# Altium schematic sheet Power.SchDoc: Power
size Letter; DocumentNumber: 4; SheetNumber: 4; SheetTotal: 11
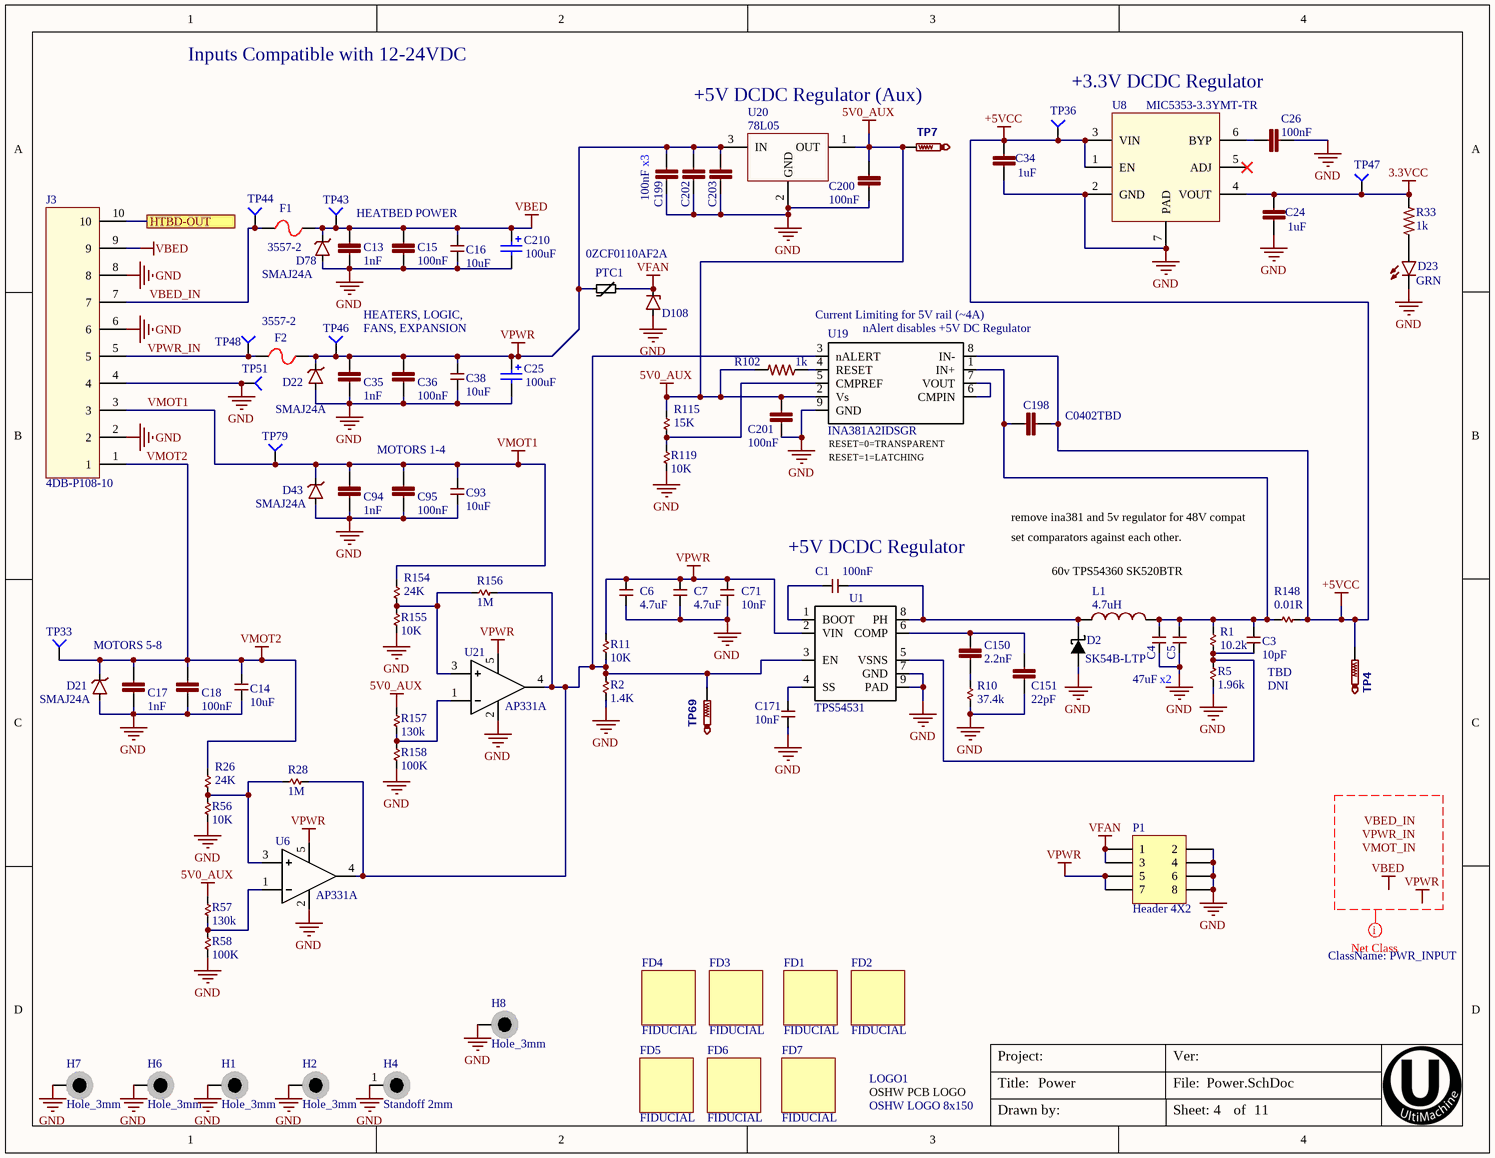
[diagram p0: Power.SchDoc]

## Parts
C1  100nF  [C0603]
C3  10pF  PART DESCRIPTION: TBD  [C0402]
C4  47uF  [C1210]
C5  47uF  [C1210]  (value not drawn)
C6  4.7uF  [C1210]
C7  4.7uF  [C1210]
C13  1nF  [C0402]
C14  10uF  [C1206]
C15  100nF  [C0603]
C16  10uF  [C1206]
C17  1nF  [C0402]
C18  100nF  [C0603]
C24  1uF  [C0402]
C25  value 100uF  [CAP-ELEC-063063077]  (hidden comment: UWT1V101MCL1GS)
C26  100nF  [C0402]
C34  1uF  [C0402]
C35  1nF  [C0402]
C36  100nF  [C0603]
C38  10uF  [C1206]
C71  10nF  [C0402]
C93  10uF  [C1206]
C94  1nF  [C0402]
C95  100nF  [C0603]
C150  2.2nF  [C0402]
C151  22pF  [C0402]
C171  10nF  [C0402]
C198  C0402TBD  [C0402]
C199  100nF  [C0603]
C200  100nF  [C0402]
C201  100nF  [C0402]
C202  100nF  [C0603]  (value not drawn)
C203  100nF  [C0603]  (value not drawn)
C210  value 100uF  [CAP-ELEC-063063077]  (hidden comment: UWT1V101MCL1GS)
D2  SK54B-LTP  [SMB_DO-214AA_LRG]
D21  SMAJ24A  [SMA-SM]
D22  SMAJ24A  [SMA-SM]
D23  GRN  [LED2012120]
D43  SMAJ24A  [SMA-SM]
D78  SMAJ24A  [SMA-SM]
D108  TVS 30V SMF  [SMF]  (value not drawn)
F1  3557-2  [3557]
F2  3557-2  [3557]
FD1  FIDUCIAL  [FIDUCIAL-1X2]
FD2  FIDUCIAL  [FIDUCIAL-1X2]
FD3  FIDUCIAL  [FIDUCIAL-1X2]
FD4  FIDUCIAL  [FIDUCIAL-1X2]
FD5  FIDUCIAL  [FIDUCIAL-1X2]
FD6  FIDUCIAL  [FIDUCIAL-1X2]
FD7  FIDUCIAL  [FIDUCIAL-1X2]
H1  Hole_3mm  [HOLE 3mm]  (no BOM)
H2  Hole_3mm  [HOLE 3mm]  (no BOM)
H4  Standoff 2mm  [Standoff SMT-M2 5mm Tall]
H6  Hole_3mm  [HOLE 3mm]  (no BOM)
H7  Hole_3mm  [HOLE 3mm]  (no BOM)
H8  Hole_3mm  [HOLE 3mm]  (no BOM)
J3  4DB-P108-10  [CON-Barrier-10-8.26mm]
L1  4.7uH  [IND_10X10]
LOGO1  OSHW LOGO 8x150  [OSHW_8X150_NOTEXT]  (no BOM)
P1  Header 4X2  [HDR2X4]
PTC1  0ZCF0110AF2A  [PTC_0ZCF]
R1  10.2k  [R0402]
R2  1.4K  [R0402]
R5  1.96k  [R0402]
R10  37.4k  [R0402]
R11  10K  [R0402]
R26  24K  [R0402]
R28  1M  [R0402]
R33  1k  [R0402]
R56  10K  [R0402]
R57  130k  [R0402]
R58  100K  [R0402]
R102  1k  [R0402]
R115  15K  [R0402]
R119  10K  [R0402]
R148  0.01R  [R0805]
R154  24K  [R0402]
R155  10K  [R0402]
R156  1M  [R0402]
R157  130k  [R0402]
R158  100K  [R0402]
TP4  TestPoint  [TP1-27]  (value not drawn)  (no BOM)
TP7  TestPoint  [TP1-27]  (value not drawn)  (no BOM)
TP33  TP4  [TP-2]  (value not drawn)  (no BOM)
TP36  TP4  [TP-2]  (value not drawn)  (no BOM)
TP43  TP4  [TP-2]  (value not drawn)  (no BOM)
TP44  TP4  [TP-2]  (value not drawn)  (no BOM)
TP46  TP4  [TP-2]  (value not drawn)  (no BOM)
TP47  TP4  [TP-2]  (value not drawn)  (no BOM)
TP48  TP4  [TP-2]  (value not drawn)  (no BOM)
TP51  TP4  [TP-2]  (value not drawn)  (no BOM)
TP69  TestPoint  [TP1-27]  (value not drawn)  (no BOM)
TP79  TP4  [TP-2]  (value not drawn)  (no BOM)
U1  TPS54531  [SOIC127P600X170_HS-9L]
U6  AP331A  [SOT23-5]
U8  MIC5353-3.3YMT-TR  [TDFN1616-6LD-PL-1]
U19  INA381A2IDSGR  [WSON8_2x2mm]
U20  78L05  [SOT-89-3]
U21  AP331A  [SOT23-5]

## Ports
HTBD-OUT

## Nets
3.3VCC: C24.1 R33.2 TP47.1 U8.4(VOUT)
5V0_AUX: C200.2 C201.2 R57.2 R102.2 R115.2 R157.2 TP7.TP U19.2(Vs) U20.1(OUT)
+5VCC: C34.1 C198.1 R148.2 TP4.TP TP36.1 U8.1(EN) U8.3(VIN) U19.8(IN-)
GND: C4.1 C5.1 C6.1 C7.1 C13.2 C14.1 C15.2 C16.1 C17.2 C18.2 C24.2 C25.2 C26.2 C34.2 C35.2 C36.2 C38.1 C71.1 C93.1 C94.2 C95.2 C151.1 C171.1 C199.2 C200.1 C201.1 C202.2 C203.2 C210.2 D2.A(ANODE) D21.A D22.A D23.C D43.A D78.A D108.A H1.?1 H2.?1 H4.1 H6.?1 H7.?1 H8.?1 J3.2 J3.4 J3.6 J3.8 P1.2 P1.4 P1.6 P1.8 R2.1 R5.1 R10.1 R56.1 R58.1 R119.1 R155.1 R158.1 TP51.1 U1.7(GND) U1.9(PAD) U6.2(GND) U8.2(GND) U8.7(PAD) U19.9(GND) U20.2(GND) U21.2(GND)
VBED: C13.1 C15.1 C16.2 C210.1 D78.K F1.2 J3.9 TP43.1
VFAN: D108.K P1.1 P1.3 PTC1.2
VMOT1: C93.2 C94.1 C95.1 D43.K J3.3 R154.1 TP79.1
VMOT2: C14.2 C17.1 C18.1 D21.K J3.1 R26.1 TP33.1
VPWR: C6.2 C7.2 C25.1 C35.1 C36.1 C38.2 C71.2 C199.1 C202.1 C203.1 D22.K F2.2 P1.5 P1.7 PTC1.1 R11.2 TP46.1 U1.2(VIN) U6.5(VCC) U20.3(IN) U21.5(VCC)
HTBD-OUT: J3.10 ; port HTBD-OUT
VBED_IN: F1.1 J3.7 TP44.1
VPWR_IN: F2.1 J3.5 TP48.1
NetC1_1: C1.1 U1.1(BOOT)
NetC1_2: C1.2 D2.K(CATHODE) L1.1 U1.8(PH)
NetC3_1: C3.1 R1.2 R5.2 U1.5(VSNS)
NetC3_2: C3.2 C4.2 C5.2 C198.2 L1.2 R1.1 R148.1 U19.1(IN+)
NetC26_1: C26.1 U8.6(BYP)
NetC150_1: C150.1 R10.2
NetC150_2: C150.2 C151.2 U1.6(COMP)
NetC171_2: C171.2 U1.4(SS)
NetD23_A: D23.A R33.1
NetR2_2: R2.2 R11.1 R28.1 R156.1 TP69.TP U1.3(EN) U6.4(OUT) U19.3(nALERT) U21.4(OUT)
NetR26_2: R26.2 R28.2 R56.2 U6.3(IN+)
NetR57_1: R57.1 R58.2 U6.1(IN-)
NetR102_1: R102.1 U19.4(RESET)
NetR115_1: R115.1 R119.2 U19.5(CMPREF)
NetR154_2: R154.2 R155.2 R156.2 U21.3(IN+)
NetR157_1: R157.1 R158.2 U21.1(IN-)
NetU19_6: U19.6(CMPIN) U19.7(VOUT)

Not connected (* = marked no-connect by the designer): U8 5(ADJ)*

## Layout directives
net class PWR_INPUT: VBED, VBED_IN, VMOT_IN, VPWR, VPWR_IN

## Notes on the sheet
- Inputs Compatible with 12-24VDC
- +5V DCDC Regulator (Aux)
- +3.3V DCDC Regulator
- (near C199) x3
- HEATBED POWER
- FANS, EXPANSION
- HEATERS, LOGIC,
- Current Limiting for 5V rail (~4A)
- (near U19) nAlert disables +5V DC Regulator
- MOTORS 1-4
- RESET=1=LATCHING
- (near U19) RESET=0=TRANSPARENT
- (near C1) +5V DCDC Regulator
- remove ina381 and 5v regulator for 48V compat
- set comparators against each other.
- 60v TPS54360 SK520BTR
- MOTORS 5-8
- x2
- Labels drawn without touching a wire or pin: VBED, VBED_IN, VMOT_IN, VPWR, VPWR_IN
- Title:
- Project:
- File:
- Ver:
- Drawn by:
- Sheet:
- of
- (in symbol OSHW LOGO 8x150) OSHW PCB LOGO

## Library data of the parts
C1 = 100nF 0603 50V X7R: CAP CER 0603 100nF 50V 10% X7R; MANUFACTURER: Kemet; MANUFACTURER #: C0603C104K5RACTU; PART DESCRIPTION: 0.1µF ±10% 50V Ceramic Capacitor X7R 0603 (1608 Metric); TOLERANCE: +/- 10%; EE_SPEC: 100nF 50V X7R 0603; DISTRIBUTOR #: 399-5089-2-ND; DISTRIBUTOR: Digi-Key; PART: C0603C104K5RACTU; VALUE: 100nF
C3 = C0402_TBD: CAP CER 0402 TBD; EE_SPEC: 50V; MANUFACTURER #: TBD; MANUFACTURER: TBD; DISTRIBUTOR #: TBD; PART: TBD; DNI: DNI; VALUE: 10pF
C4 C5 = 47uF 1210 10V X5R: CAP CER 47UF 10V X5R 1210; MANUFACTURER: Murata; MANUFACTURER #: GRM32ER61A476KE20L; PART DESCRIPTION: 47µF ±10% 10V Ceramic Capacitor X5R 1210 (3225 Metric); TOLERANCE: 10%; EE_SPEC: 10V, 3mOhm; DISTRIBUTOR #: 490-3887-1-ND; DISTRIBUTOR: Digikey; PART: GRM32ER61A476KE20L; VALUE: 47uF
C6 C7 = 4.7uF 1210 50V X7R: CAP CER 4.7UF 50V X7R 1210; MANUFACTURER: Murata; MANUFACTURER #: GRM32ER71H475KA88L; PART DESCRIPTION: 4.7µF ±10% 50V Ceramic Capacitor X7R 1210 (3225 Metric); TOLERANCE: 10%; DISTRIBUTOR #: 490-1864-1-ND; DISTRIBUTOR: Digikey; PART: GRM32ER71H475KA88L; EE_SPEC: 50V; VALUE: 4.7uF
C13 C17 C35 C94 = CAP 1nF 50V 0402 X7R: 1000pF 50V Ceramic Capacitor X7R 0402 (1005 Metric) 0.039" L x 0.020" W (1.00mm x 0.50mm); MANUFACTURER: Murata; MANUFACTURER #: GRM155R71H102KA01D; PART DESCRIPTION: 1000pF ±10% 50V Ceramic Capacitor X7R 0402 (1005 Metric); TOLERANCE: 10%; VALUE: 1nF; DISTRIBUTOR #: 490-1303-2-ND; DISTRIBUTOR: Digi-Key Electronics; PART: GRM155R71H102KA01D; EE_SPEC: 50V
C14 C16 C38 C93 = 10uF 1206 50V X5R: CAP CER 10UF 50V 10% X5R 1206; MANUFACTURER: Taiyo Yuden; MANUFACTURER #: UMK316BBJ106ML-T; PART: CAP CER 10UF 50V X5R 1206; PART DESCRIPTION: 10µF ±20% 50V Ceramic Capacitor X5R 1206 (3216 Metric); TOLERANCE: 10%; EE_SPEC: 50V; MANUFACTURER2#: UMK316BBJ106ML-T; VALUE: 10uF
C15 C18 C36 C95 = C0603C104K5RACTU: CAP CER 0603 100nF 50V 10% X7R; MANUFACTURER: Kemet; PART DESCRIPTION: 0.10µF ±10% 50V Ceramic Capacitor X7R 0603 (1608 Metric); EE_SPEC: 100nF 50V X7R 0603; VALUE: 100nF; MANUFACTURER #: C0603C104K5RACTU; DISTRIBUTOR #: 399-5089-2-ND; DISTRIBUTOR: Digi-Key Electronics; PART: C0603C104K5RACTU; TOLERANCE: 10%
C24 C34 = GRM155R60J105KE19D: CAP CER 0402 1uF 6.3V 10% X5R; MANUFACTURER: Murata; PART DESCRIPTION: 1µF ±10% 6.3V Ceramic Capacitor X5R 0402 (1005 Metric); EE_SPEC: 1uF 6.3V X5R 0402; VALUE: 1uF; MANUFACTURER #: GRM155R60J105KE19D; DISTRIBUTOR #: 490-1320-2-ND; DISTRIBUTOR: Digi-Key Electronics; PART: GRM155R60J105KE19D; TOLERANCE: 10%
C25 C210 = UWT1V101MCL1GS: CAP ALUM 100UF 35V 20% SMD; MANUFACTURER: Nichicon; PART DESCRIPTION: 100µF 35V Aluminum Capacitors Radial, Can - SMD 1000 Hrs @ 105°C; EE_SPEC: 100uF 35V Al-El; MANUFACTURER #: UWT1V101MCL1GS; DISTRIBUTOR #: 493-2203-2-ND; DISTRIBUTOR: Digi-Key Electronics; PART: UWT1V101MCL1GS; TOLERANCE: 20%
C26 C200 C201 = GRM155R71C104KA88D: CAP CER 0402 100nF 16V 10% X7R; MANUFACTURER: Murata; PART DESCRIPTION: 0.10µF ±10% 16V Ceramic Capacitor X7R 0402 (1005 Metric); EE_SPEC: 100nF 16V X7R 0402; VALUE: 100nF; MANUFACTURER #: GRM155R71C104KA88D; DISTRIBUTOR #: 490-3261-2-ND; DISTRIBUTOR: Digi-Key Electronics; PART: GRM155R71C104KA88D; TOLERANCE: 10%
C71 C171 = 10nF 0402 50V X7R: CAP CER 10nF 50V X7R 0402; PART DESCRIPTION: 10000pF ±5% 50V Ceramic Capacitor X7R 0402 (1005 Metric); MANUFACTURER #: GRM155R71H103JA88D; MANUFACTURER: Murata; TOLERANCE: 5%; EE_SPEC: 50V; DISTRIBUTOR #: 490-7763-1-ND; DISTRIBUTOR: Digikey; PART: GRM155R71H103JA88D; VALUE: 10nF
C150 = 2.2nF 25V C0G 0402: CAP CER 0402 2.2nF 25V C0G; MANUFACTURER: Kemet; MANUFACTURER #: C0402C222J3GACTU; PART DESCRIPTION: 2200pF ±5% 25V Ceramic Capacitor C0G, NP0 0402 (1005 Metric); EE_SPEC: 25; TOLERANCE: 5%; VALUE: 2.2nF; DISTRIBUTOR #: 399-8957-2-ND; DISTRIBUTOR: Digikey; PART: C0402C222J3GACTU
C151 = 22pF 0402 50V C0G: CAP CER 0402 22pF 50V 5% C0G; Manufacturer: AVX; MANUFACTURER #: 04025A220JAT2A; Part Description: 22pF ±5% 50V Ceramic Capacitor C0G, NP0 0402 (1005 Metric); EE_SPEC: 22pF 5% 50V NP0 0402; VALUE: 22pF; DISTRIBUTOR #: 478-1074-2-ND; DISTRIBUTOR: Digi-Key; PART: 04025A220JAT2A; Tolerance: 5%
C198 = C0402TBD: Capacitor Non Polarized; MANUFACTURER #: DNI-C0402TBD; VALUE: C0402TBD; PART: DNI-C0402TBD; DNI: DNI
C199 C202 C203 = C0603C104K5RACTU: CAP CER 0603 100nF 50V 10% X7R; Manufacturer: Kemet; Part Description: 0.1µF ±10% 50V Ceramic Capacitor X7R 0603 (1608 Metric); EE_SPEC: 100nF 50V X7R 0603; VALUE: 100nF; MANUFACTURER #: C0603C104K5RACTU; DISTRIBUTOR #: 399-5089-2-ND; DISTRIBUTOR: Digi-Key Electronics; PART: C0603C104K5RACTU; Tolerance: 10%
D2 = SK54B: DIODE SCHOTTKY 40V 5A SMB_DO214AA; MANUFACTURER: MCC; VOLTAGE: 40Vrb; PART: SK54B-LTP; MANUFACTURER #: SK54B-LTP; DISTRIBUTOR: DIGI-KEY; DISTRIBUTOR #: SK54B-LTPMSTR-ND
D21 D22 D43 D78 = SMAJ24A: TVS DIODE 24V 38.9V SMA; Manufacturer: Bourns Inc; EE_SPEC: 24Vrs 38.9Vc; MANUFACTURER #: SMAJ24A; DISTRIBUTOR #: SMAJ24ABTR-ND; DISTRIBUTOR: Digi-Key; Part Description: TVS DIODE 24V 38.9V SMA; VALUE: SMAJ24A; PART: SMAJ24A
D23 = 5988170107F: LED 0805 Green; MANUFACTURER: Dialight; PART DESCRIPTION: Green 566nm LED Indication - Discrete 2V 0805 (2012 Metric); TOLERANCE: -NA-; EE_SPEC: Vf=2V; VALUE: GRN; MANUFACTURER #: 5988170107F; DISTRIBUTOR #: 350-2044-2-ND; DISTRIBUTOR: Digi-Key Electronics; PART: 5988170107F
D108 = TVS 30V SMF: TVS DIODE 30VWM 48.4VC SMF; MANUFACTURER: Vishay; MANUFACTURER #: SMF30A-E3-08; PART: TVS Diode 48.4VC; TOLERANCE: -NA-; EE_SPEC: 30Vrs 48.4Vc; VALUE: -NA-; DISTRIBUTOR #: SMF30A-E3-08GITR-ND; DISTRIBUTOR: Digikey; PART DESCRIPTION: TVS DIODE 30VWM 48.4VC SMF
F1 F2 = 3557-2: FUSE PTH ATO; MANUFACTURER: Keystone; PART DESCRIPTION: Fuse Block 30A 500V 1 Circuit Blade PCB; TOLERANCE: -NA-; VALUE: -NA-; EE_SPEC: 500V; MANUFACTURER #: 3557-2; DISTRIBUTOR #: 36-3557-2-ND; DISTRIBUTOR: Digi-Key Electronics; PART: 3557-2
FD1-FD7 = FIDUCIAL: MANUFACTURER #: NOTAPART-Fiducial; PART: NOTAPART-Fiducial
H1 H2 H6-H8 = Hole_3mm: MANUFACTURER #: NOTAPART-Hole
H4 = Standoff SMT M2 5mm Tall: Round Standoff Threaded M2x0.4 Steel 0.197" (5.00mm); MANUFACTURER #: 9774050243R; MANUFACTURER: Würth Elektronik; PART DESCRIPTION: Round Standoff Threaded M2x0.4 Steel 0.197" (5.00mm)
J3 = 10 Pos barrier: CONN BARRIER STRIP 10CIRC 0.325"; Manufacturer: TE; Part Description: 10 Circuit 0.325" (8.26mm) Barrier Block Connector, Screws with Captive Plate; Tolerance: NA; DISTRIBUTOR: Digi-Key; MANUFACTURER #: 4DB-P108-10; PART: 4DB-P108-10; VALUE: 4DB-P108-10
L1 = 4.7uH 10A: FIXED IND 4.7UH 10A 15.5 MOHM; Manufacturer: Bourns; MANUFACTURER #: SRP1038A-4R7M; Part Description: 4.7µH Shielded Wirewound Inductor 10A 15.5 mOhm Max Nonstandard; EE_SPEC: Irms=10A, Isat=17A, DCR=0.016Ohms; Tolerance: +/- 20%; Value: 4.7uH; DISTRIBUTOR #: SRP1038A-4R7MTR-ND; DISTRIBUTOR: Digi-Key; PART: SRP1038A-4R7M
LOGO1 = OSHW LOGO 8x150: MANUFACTURER #: NOTAPART-OSHW LOGO; PART: NOTAPART-OSHW LOGO
P1 = Header 4X2: Header, 4-Pin, Dual row; MANUFACTURER #: 2213S-08G; MANUFACTURER: Multicomp; PART DESCRIPTION: Board-To-Board Connector, 2.54 mm, 8 Contacts, Header, 2213S Series, Through Hole, 2 Rows; TOLERANCE: -NA-; VALUE: HDR8; DISTRIBUTOR #: 08N6790; DISTRIBUTOR: Future; PART: 2213S-08G; EE_SPEC: -NA-
PTC1 = PTC RESET FUSE 60V 1.1A 2920: MANUFACTURER: Bel Fuse Inc.; PART DESCRIPTION: Polymeric PTC Resettable Fuse 60V 1.1 A Ih Surface Mount 2920 (7351 Metric), Concave; MANUFACTURER #: 0ZCF0110AF2A; PART: 0ZCF0110AF2A
R1 = 10.2k 1% 0402: RES SMD 10.2K OHM 1% 1/16W 0402; MANUFACTURER: Yageo; MANUFACTURER #: RC0402FR-0710K2L; PART DESCRIPTION: 10.2 kOhms ±1% 0.063W, 1/16W Chip Resistor 0402 (1005 Metric) Moisture Resistant Thick Film; DISTRIBUTOR #: YAG2950TR-ND; DISTRIBUTOR: Digikey; PART: RC0402FR-0710K2L; TOLERANCE: 1%; EE_SPEC: 1/16W; VALUE: 10.2k
R2 = 1.4k 1% 0402: RES SMD 1.4K OHM 1% 1/16W 0402; MANUFACTURER: Stackpole; MANUFACTURER #: RMCF0402FT1K40; Part Description: 1.4 kOhms ±1% 0.063W, 1/16W Chip Resistor 0402 (1005 Metric) Automotive AEC-Q200 Thick Film; Tolerance: +/- 1%; EE_SPEC: 1.4k 1% 0402; VALUE: 1.4K; PART: RMCF0402FT1K40
R5 = 1.96k 1% 0402: RES SMD 1.96K OHM 1% 1/16W 0402; MANUFACTURER: Yageo; MANUFACTURER #: RC0402FR-071K96L; PART DESCRIPTION: 1.96 kOhms ±1% 0.063W, 1/16W Chip Resistor 0402 (1005 Metric) Moisture Resistant Thick Film; VALUE: 1.96k; DISTRIBUTOR #: 311-1.96KLRTR-ND; DISTRIBUTOR: Digikey; EE_SPEC: 1/16W; PART: RC0402FR-071K96L; TOLERANCE: 1%
R10 = 37.4K 1% 0402: RES SMD 37.4K OHM 1% 1/16W 0402; MANUFACTURER: Yageo; MANUFACTURER #: RC0402FR-0737K4L; PART DESCRIPTION: 37.4 kOhms ±1% 0.063W, 1/16W Chip Resistor 0402 (1005 Metric) Moisture Resistant Thick Film; DISTRIBUTOR #: YAG3138CT-ND; DISTRIBUTOR: Digikey; PART: RC0402FR-0737K4L; TOLERANCE: 1%; EE_SPEC: 1/16W; VALUE: 37.4k
R11 R56 R119 R155 = 10k 1% 0402: RES SMD 10K OHM 1% 1/16W 0402; MANUFACTURER: Yageo; MANUFACTURER #: RC0402FR-0710KP; PART DESCRIPTION: 10k Ohm ±1% 0.063W, 1/16W Chip Resistor 0402 (1005 Metric) Moisture Resistant Thick Film; DISTRIBUTOR #: YAG1249TR-ND; DISTRIBUTOR: Digikey; PART: RC0402FR-0710KP; TOLERANCE: 1%; EE_SPEC: 1/16W; VALUE: 10K
R26 R154 = 24k 1% 0402: RES SMD 24K OHM 1% 1/16W 0402; MANUFACTURER: Visha Dale; MANUFACTURER #: CRCW040224K0FKEDC; Part Description: 24 kOhms ±1% 0.063W, 1/16W Chip Resistor 0402 (1005 Metric)  Thick Film; Tolerance: +/- 1%; EE_SPEC: 24k 1% 0402; VALUE: 24K; PART: CRCW040224K0FKEDC
R28 R156 = 1M 5% 0402: RES 0402 1M 100mW 5%; MANUFACTURER: Panasonic; MANUFACTURER #: ERJ2GEJ105X; PART DESCRIPTION: 1M Ohm ±5% 0.1W, 1/10W Chip Resistor 0402 (1005 Metric) Automotive AEC-Q200 Thick Film; EE_SPEC: 1/10W; DISTRIBUTOR #: P1.0MJTR-ND; DISTRIBUTOR: Digikey; PART: ERJ2GEJ105X; TOLERANCE: 5%; VALUE: 1M
R33 R102 = RK73H1ETTP1001F: RES 0402 1k 63mW 1%; MANUFACTURER: Yageo; MANUFACTURER #: RC0402FR-071KL; PART DESCRIPTION: 1k Ohm ±1% 0.063W, 1/16W Chip Resistor 0402 (1005 Metric) Moisture Resistant Thick Film; EE_SPEC: 1/16W; VALUE: 1k; DISTRIBUTOR #: 311-1.00KLRTR-ND; DISTRIBUTOR: Digi-Key Electronics; PART: RC0402FR-071KL; TOLERANCE: 1%
R57 R157 = 130k 1% 0402: RES SMD 130K OHM 5% 1/16W 0402; MANUFACTURER: Yageo; MANUFACTURER #: RC0402JR-07130KL; PART DESCRIPTION: 130 kOhms ±5% 0.063W, 1/16W Chip Resistor 0402 (1005 Metric) Moisture Resistant Thick Film; TOLERANCE: 1%; DISTRIBUTOR #: YAG3273CT-ND; DISTRIBUTOR: Digikey; PART: RC0402JR-07130KL; EE_SPEC: 1/16W; VALUE: 130k
R58 R158 = 100k 1% 0402: RES SMD 100K OHM 1% 1/16W 0402; MANUFACTURER: Samsung; MANUFACTURER #: RC1005F104CS; PART DESCRIPTION: 100k Ohm ±1% 0.063W, 1/16W Chip Resistor 0402 (1005 Metric) Moisture Resistant Thick Film; DISTRIBUTOR #: 1276-3432-1-ND; DISTRIBUTOR: Digikey; PART: RC1005F104CS; TOLERANCE: 1%; EE_SPEC: 1/16W; VALUE: 100K
R115 = 15K 1% 0402: RES SMD 15K 1% 1/16W 0402; MANUFACTURER: Samsung; MANUFACTURER #: RC1005F153CS; PART DESCRIPTION: 15K Ohm ±1% 0.063W, 1/16W Chip Resistor 0402 (1005 Metric) Moisture Resistant Thick Film; DISTRIBUTOR #: 1276-3442-2-ND; DISTRIBUTOR: Digikey; PART: RC1005F153CS; TOLERANCE: 1%; EE_SPEC: 1/16W; VALUE: 15K
R148 = 0.01R 1% 0805: RES 0.01 OHM 1% 1/2W 0805; MANUFACTURER: Susumu; MANUFACTURER #: KRL1220E-M-R010-F-T5; PART DESCRIPTION: 10 mOhms ±1% 0.5W, 1/2W Chip Resistor 0805 (2012 Metric) Automotive AEC-Q200, Current Sense Metal Foil; EE_SPEC: 0.5W; DISTRIBUTOR #: 408-1544-2-ND; DISTRIBUTOR: Digikey; PART: KRL1220E-M-R010-F-T5; TOLERANCE: 1%; VALUE: 0.01R
TP4 TP7 TP69 = TestPoint: Test Point
TP33 TP36 TP43 TP44 TP46-TP48 TP51 TP79 = Socket: MANUFACTURER #: NOTAPART-Testpoint; PART: NOTAPART-Testpoint
U1 = TPS54531: IC REG BUCK ADJ 5A 8SOPWRPAD; MANUFACTURER #: TPS54531DDAR; MANUFACTURER: TI; PART DESCRIPTION: Buck Switching Regulator IC Positive Adjustable 0.8V 1 Output 5A 8-PowerSOIC (0.154", 3.90mm Width); EE_SPEC: 28Vin_max, 5A, 570kHz; VALUE: TPS54531; DISTRIBUTOR #: 296-40801-2-ND; DISTRIBUTOR: Digikey; PART: TPS54531DDAR
U6 U21 = AP331A: IC QUAD DIFF COMPARATOR 14 -SOIC; PART: AP331AWG-7; MANUFACTURER: TEXAS INSTRUMENTS; MANUFACTURER #: AP331AWG-7; DISTRIBUTOR: DIGI-KEY; DISTRIBUTOR #: AP331AWGDITR-ND; VALUE: AP331A
U8 = MIC5353-3.3YMT-TR: LDO 3.3V 500mA - low ESR Cout; MANUFACTURER: Microchip; PART DESCRIPTION: Linear Voltage Regulator IC Positive Fixed 1 Output 3.3V 500mA 6-TMLF® (1.6x1.6); TOLERANCE: -NA-; VALUE: 3.3V LDO; MANUFACTURER #: MIC5353-3.3YMT-TR; DISTRIBUTOR #: 576-3680-2-ND; DISTRIBUTOR: Digi-Key Electronics; PART: MIC5353-3.3YMT-TR; EE_SPEC: 500mA
U19 = INA381_ALT: IC COMPARATOR BIDIR 8WSON; MANUFACTURER: TI; TOLERANCE: -NA-; EE_SPEC: Vcc 2.7-5.5V; Vcm 26V; MANUFACTURER #: INA381A2IDSGR; DISTRIBUTOR #: 296-49078-2-ND; DISTRIBUTOR: Digikey; PART: INA381A2IDSGR; VALUE: INA381A2
U20 = 78L05: IC REG LINEAR 5V 100MA SOT89-3; MANUFACTURER #: L78L05ABUTR; MANUFACTURER: ST; PART DESCRIPTION: Linear Voltage Regulator IC Positive Fixed 1 Output 5V 100mA SOT-89-3; TOLERANCE: -NA-; VALUE: 5V LDO; EE_SPEC: Vin 30V, Iout 0.1A; DISTRIBUTOR #: 497-1181-2-ND; DISTRIBUTOR: Digikey; PART: L78L05ABUTR